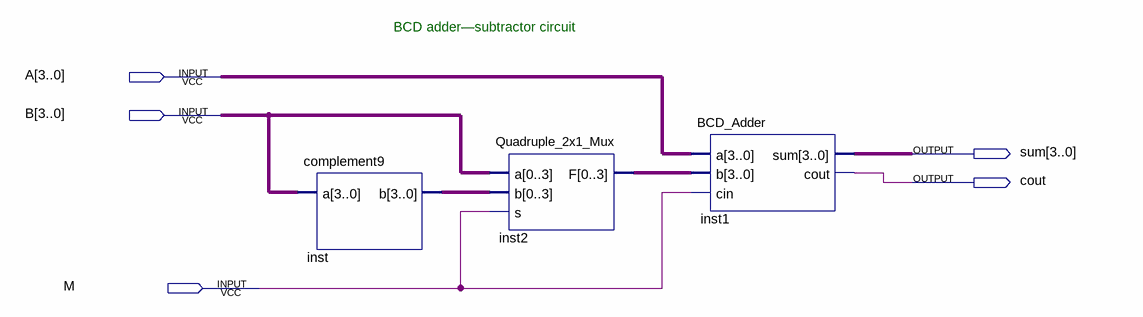
[diagram p0: schematic sheet]
// Quartus schematic BlockDiagram.bdf as structural Verilog: 3 symbols, 5 pins
module BlockDiagram (
  input  [3:0] A,
  input  [3:0] B,
  input  M,
  output [3:0] sum,
  output cout
);

  wire [3:0] inst2_f, inst_b;

  complement9 inst (.a(B), .b(inst_b));
  Quadruple_2x1_Mux inst2 (.a(B), .b(inst_b), .s(M), .F(inst2_f));
  BCD_Adder inst1 (.a(A), .b(inst2_f), .cin(M), .sum(sum), .cout(cout));

  // Notes on the sheet:
  //   BCD adder—subtractor circuit
endmodule
